# Altium schematic sheet SiPM_16Ch_Sc3.SchDoc
size A4
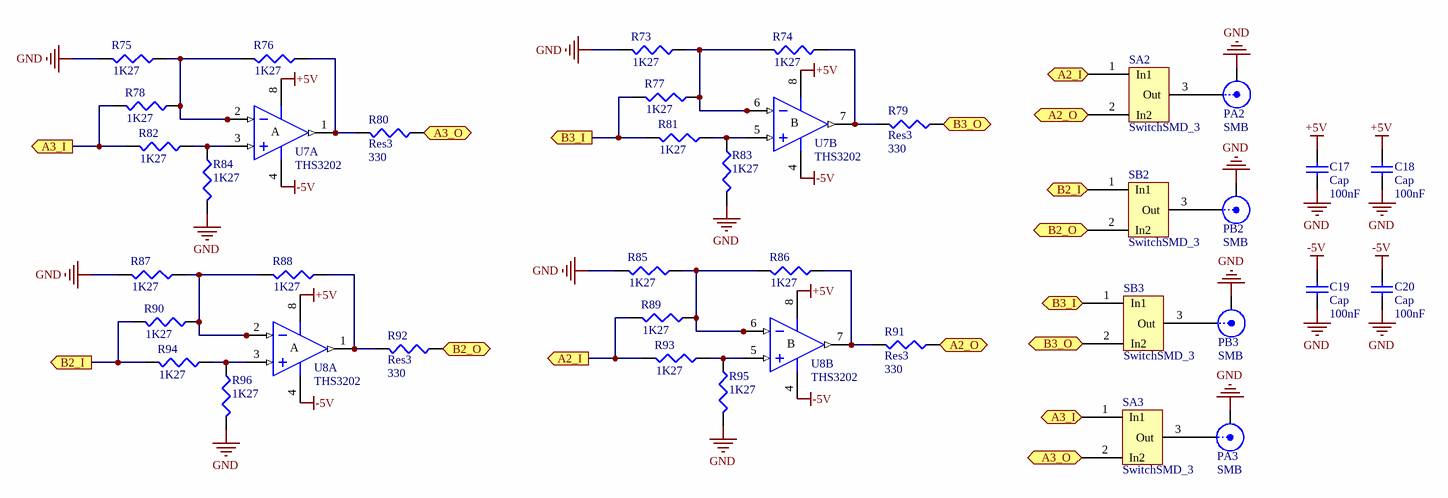
[diagram p0: SiPM_16Ch_Sc3.SchDoc]

## Parts
C17  Cap  value 100nF  [1608[0603]]
C18  Cap  value 100nF  [1608[0603]]
C19  Cap  value 100nF  [1608[0603]]
C20  Cap  value 100nF  [1608[0603]]
PA2  SMB  [SMB_V-RJ45]
PA3  SMB  [SMB_V-RJ45]
PB2  SMB  [SMB_V-RJ45]
PB3  SMB  [SMB_V-RJ45]
R73  value 1K27  [J1-0603]  (hidden comment: Res3)
R74  value 1K27  [J1-0603]  (hidden comment: Res3)
R75  value 1K27  [J1-0603]  (hidden comment: Res3)
R76  value 1K27  [J1-0603]  (hidden comment: Res3)
R77  value 1K27  [J1-0603]  (hidden comment: Res3)
R78  value 1K27  [J1-0603]  (hidden comment: Res3)
R79  Res3  value 330  [J1-0603]
R80  Res3  value 330  [J1-0603]
R81  value 1K27  [J1-0603]  (hidden comment: Res3)
R82  value 1K27  [J1-0603]  (hidden comment: Res3)
R83  value 1K27  [J1-0603]  (hidden comment: Res3)
R84  value 1K27  [J1-0603]  (hidden comment: Res3)
R85  value 1K27  [J1-0603]  (hidden comment: Res3)
R86  value 1K27  [J1-0603]  (hidden comment: Res3)
R87  value 1K27  [J1-0603]  (hidden comment: Res3)
R88  value 1K27  [J1-0603]  (hidden comment: Res3)
R89  value 1K27  [J1-0603]  (hidden comment: Res3)
R90  value 1K27  [J1-0603]  (hidden comment: Res3)
R91  Res3  value 330  [J1-0603]
R92  Res3  value 330  [J1-0603]
R93  value 1K27  [J1-0603]  (hidden comment: Res3)
R94  value 1K27  [J1-0603]  (hidden comment: Res3)
R95  value 1K27  [J1-0603]  (hidden comment: Res3)
R96  value 1K27  [J1-0603]  (hidden comment: Res3)
SA2  SwitchSMD_3  [SwitchSMD_0603]
SA3  SwitchSMD_3  [SwitchSMD_0603]
SB2  SwitchSMD_3  [SwitchSMD_0603]
SB3  SwitchSMD_3  [SwitchSMD_0603]
U7  THS3202  [SO-8_M]  (parts A,B of 2)
U8  THS3202  [SO-8_M]  (parts A,B of 2)

## Ports
A2_I (out), A2_O (out), A3_I (out), A3_O (out), B2_I (out), B2_O (out), B3_I (out), B3_O (out)

## Nets
+5V: C17.2 C18.2 U7.8(V+) U8.8(V+)
-5V: C19.2 C20.2 U7.4(V-) U8.4(V-)
GND: C17.1 C18.1 C19.1 C20.1 PA2.2(Y) PA3.2(Y) PB2.2(Y) PB3.2(Y) R73.2 R75.2 R83.2 R84.2 R85.2 R87.2 R95.2 R96.2
A2_I: R89.2 R93.2 SA2.1(In1) ; port A2_I
A2_O: R91.1 SA2.2(In2) ; port A2_O
A3_I: R78.2 R82.2 SA3.1(In1) ; port A3_I
A3_O: R80.1 SA3.2(In2) ; port A3_O
B2_I: R90.2 R94.2 SB2.1(In1) ; port B2_I
B2_O: R92.1 SB2.2(In2) ; port B2_O
B3_I: R77.2 R81.2 SB3.1(In1) ; port B3_I
B3_O: R79.1 SB3.2(In2) ; port B3_O
NetPA2_1: PA2.1(X) SA2.3(Out)
NetPA3_1: PA3.1(X) SA3.3(Out)
NetPB2_1: PB2.1(X) SB2.3(Out)
NetPB3_1: PB3.1(X) SB3.3(Out)
NetR73_1: R73.1 R74.2 R77.1 U7.6(IN-)
NetR74_1: R74.1 R79.2 U7.7(OUT)
NetR75_1: R75.1 R76.2 R78.1 U7.2(IN-)
NetR76_1: R76.1 R80.2 U7.1(OUT)
NetR81_1: R81.1 R83.1 U7.5(IN+)
NetR82_1: R82.1 R84.1 U7.3(IN+)
NetR85_1: R85.1 R86.2 R89.1 U8.6(IN-)
NetR86_1: R86.1 R91.2 U8.7(OUT)
NetR87_1: R87.1 R88.2 R90.1 U8.2(IN-)
NetR88_1: R88.1 R92.2 U8.1(OUT)
NetR93_1: R93.1 R95.1 U8.5(IN+)
NetR94_1: R94.1 R96.1 U8.3(IN+)

## Notes on the sheet
- (in symbol AD8002AR, part A) A
- (in symbol AD8002AR, part B) B

## Library data of the parts
C17-C20 = Cap: Capacitor; Published: 8-Jun-2000; LatestRevisionDate: 17-Jul-2002; LatestRevisionNote: Re-released for DXP Platform.; PackageReference: RAD-0.3; Publisher: Altium Limited; PackageDescription: Radial Cap, Thru-Hole; 2 Leads; 0.3 in Pin Spacing
PA2 PA3 PB2 PB3 = SMB: SMB Straight Connector; LatestRevisionDate: 17-Jul-2002; LatestRevisionNote: Re-released for DXP Platform.; Publisher: Altium Limited
R73-R96 = Res3: Resistor; Published: 8-Jun-2000; LatestRevisionDate: 29-May-2009; LatestRevisionNote: IPC-7351 Footprint Added.; PackageReference: J1-0603; Publisher: Altium Limited; PackageDescription: Chip Resistor
U7 U8 = AD8002AR: Dual 600MHz, 50mW Current Feedback Amplifier; Published: 8-Jun-2000; LatestRevisionDate: 13-Apr-2006; LatestRevisionNote: IPC-7351 Footprint Added.; DatasheetVersion: REV. C 1999; PackageVersion: revA; PackageReference: SO-8; Publisher: Altium Limited; PackageDescription: 8-Pin Small Outline Integrated Circuit 1.27 mm Pitch; Code_JEDEC: MS-012-AA; Code_IPC: SOIC127P600-8; ComponentLink1Description: Manufacturer Link; ComponentLink1URL: http://www.analog.com/en/prod/0,,759_786_AD8002%2C00.html; ComponentLink2Description: Datasheet; ComponentLink2URL: http://www.analog.com/UploadedFiles/Data_Sheets/147523773AD8002_d.pdf